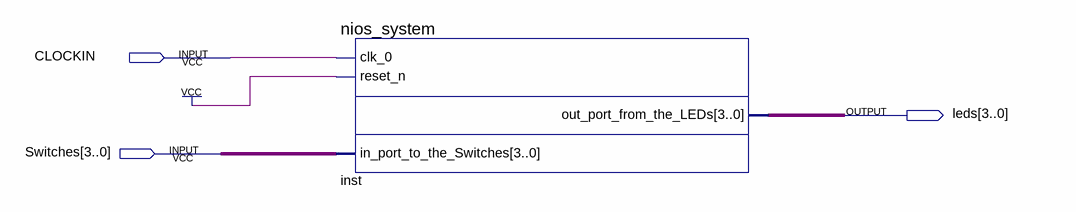
[diagram p0: schematic sheet]
// Quartus schematic lights.bdf as structural Verilog: 1 symbols, 3 pins
module lights (
  input  CLOCKIN,
  input  [3:0] Switches,
  output [3:0] leds
);

  nios_system inst (.clk_0(CLOCKIN), .reset_n(1'b1), .in_port_to_the_Switches(Switches), .out_port_from_the_LEDs(leds));
endmodule
